# EAGLE design Slicow Senzor (EAGLE 5.11)
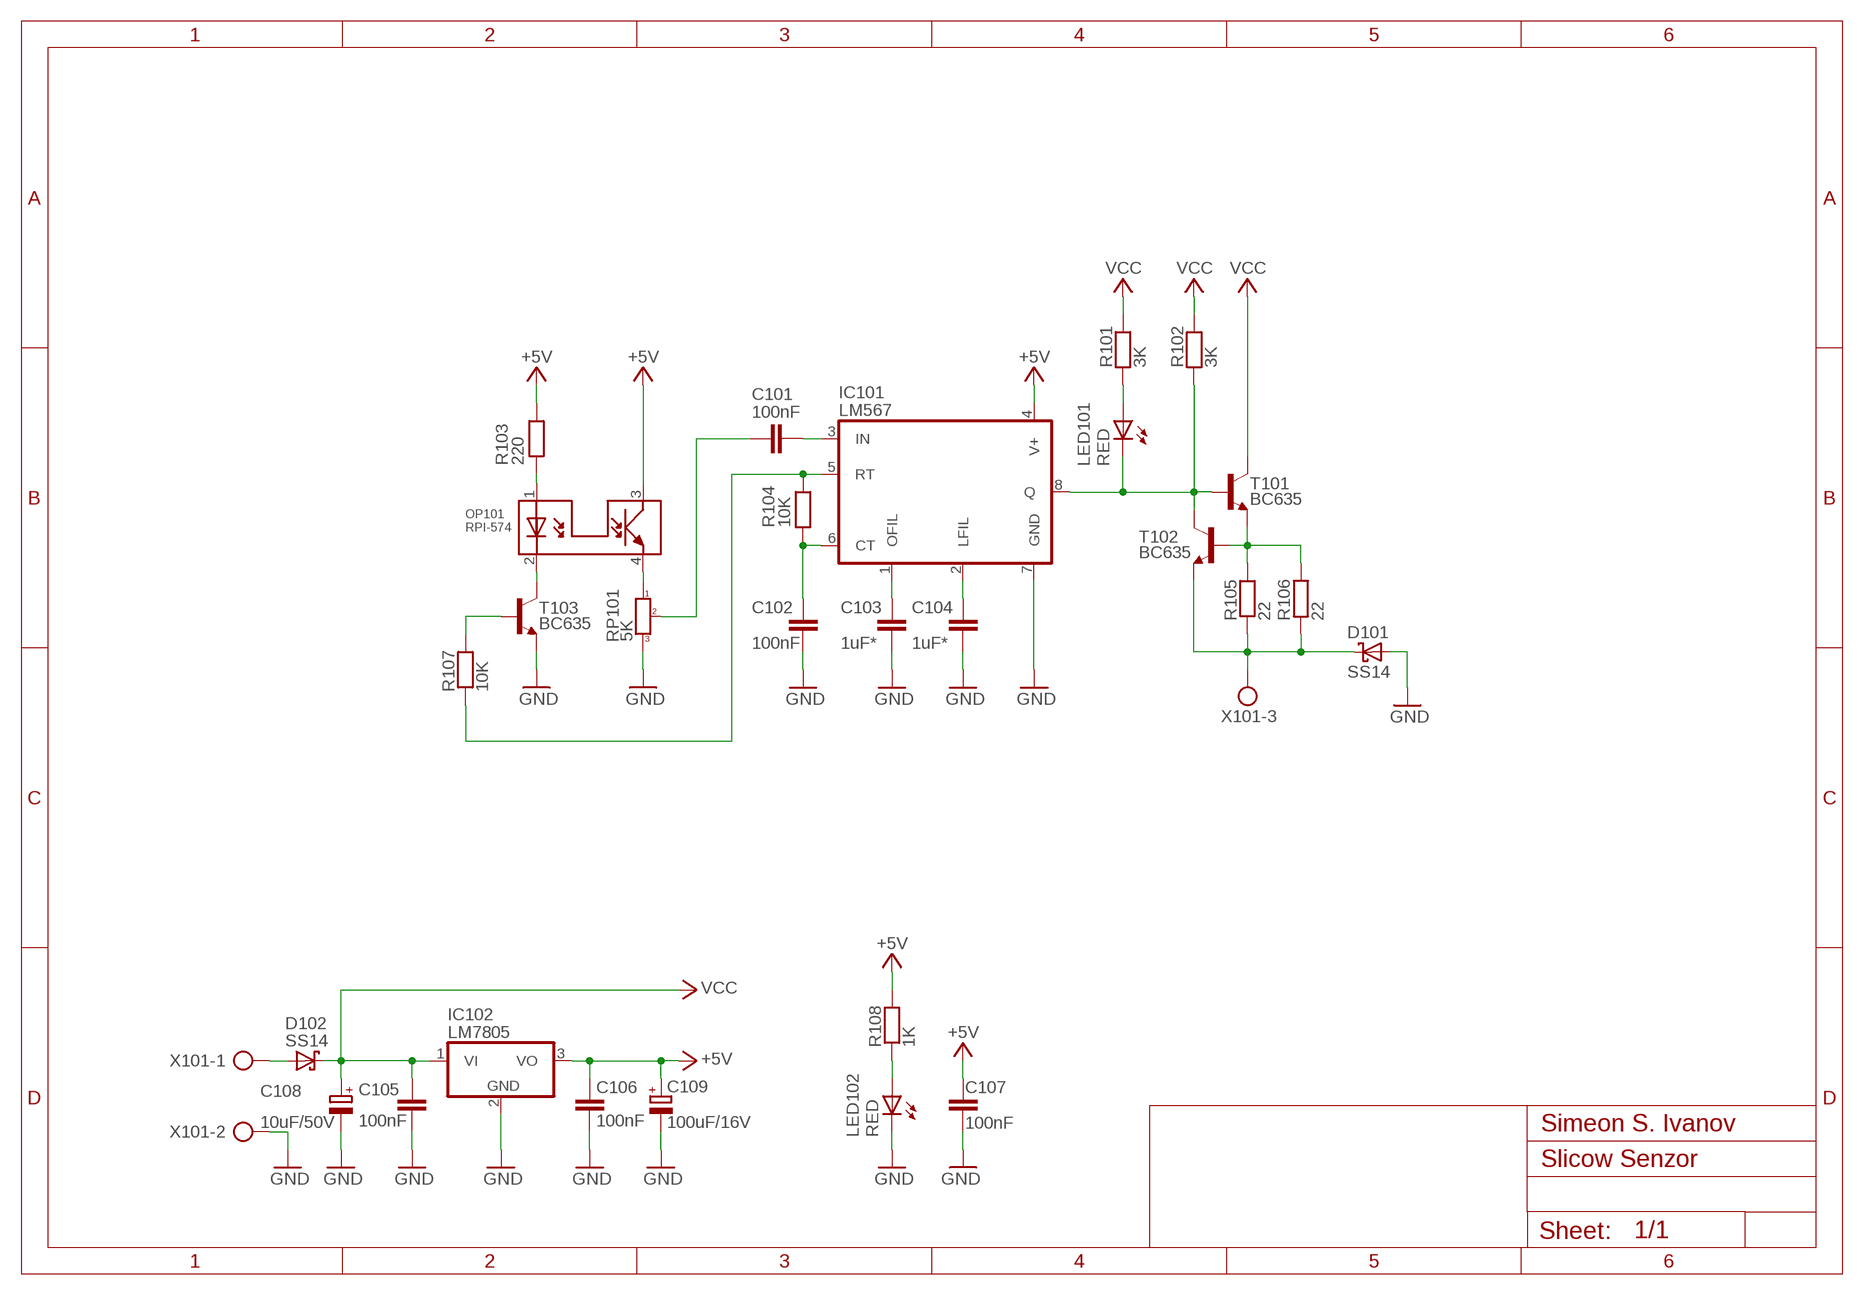
[diagram p0: schematic, sheet 1]

## Parts
C101  100nF  C-EUC0805  [C0805]
C102  100nF  C-EUC0805  [C0805]
C103  1uF*  C-EUC0805  [C0805]
C104  1uF*  C-EUC0805  [C0805]
C105  100nF  C-EUC0805  [C0805]
C106  100nF  C-EUC0805  [C0805]
C107  100nF  C-EUC0805  [C0805]
C108  10uF/50V  CPOL-EU_Ø250  [CP100X80X24]
C109  100uF/16V  CPOL-EU_Ø250  [CP100X80X24]
D101  SS14  1N581SMD  [DO214AC]
D102  SS14  1N581SMD  [DO214AC]
IC101  LM567  LM567DIL8-HOME  [DIL8-HOME]
IC102  LM7805  78TO220V-HOME  [TO220V-HOME]
LED101  RED  LEDLED3MM-HOME  [LED3MM-HOME]
LED102  RED  LEDLED3MM-HOME  [LED3MM-HOME]
OP101  RPI-574  RPI-574HOME  [RPI-574-HOME]
R101  3K  R-EU_3  [R200X86X24]
R102  3K  R-EU_3  [R200X86X24]
R103  220  R-EU_3  [R200X86X24]
R104  10K  R-EU_1  [R100X80X24]
R105  22  R-EU_1  [R100X80X24]
R106  22  R-EU_1  [R100X80X24]
R107  10K  R-EU_15  [R250X80X19]
R108  1K  R-EU_16  [R400X80X19]
RP101  5K  RP-EU_HOME  [RP0]
T101  BC635  BC635-NPN-TO92-BCE-HOME  [TO92-BCE-HOME]
T102  BC635  BC635-NPN-TO92-BCE-HOME  [TO92-BCE-HOME]
T103  BC635  BC635-NPN-TO92-BCE-HOME  [TO92-BCE-HOME]
X101  AK500/31  [AWG/3-H]

## Nets
+5V: C106.1 C107.1 C109.+(+1) IC101.4(V+) IC102.3(VO) OP101.3(C) R103.P$2 R108.P$2
GND: C102.2 C103.2 C104.2 C105.2 C106.2 C107.2 C108.-(-1) C109.-(-1) D101.A IC101.7(GND) IC102.2(GND) LED102.K(C) RP101.3 T103.E X101.2
N$1: R105.P$2 R106.P$1 T101.E T102.B
N$2: C101.2 IC101.3(IN)
N$3: D102.A X101.1
N$4: R107.P$2 T103.B
N$5: OP101.2(K) T103.C
N$6: C102.1 IC101.6(CT) R104.P$1
N$7: LED102.A R108.P$1
N$8: C103.1 IC101.1(OFIL)
N$9: C104.1 IC101.2(LFIL)
N$10: D101.C R105.P$1 R106.P$2 T102.E X101.3
N$11: IC101.8(Q) LED101.K(C) R102.P$1 T101.B T102.C
N$12: C101.1 RP101.2
N$13: LED101.A R101.P$1
N$14: OP101.4(E) RP101.1
N$15: OP101.1(A) R103.P$1
OSC: IC101.5(RT) R104.P$2 R107.P$1
VCC: C105.1 C108.+(+1) D102.C IC102.1(VI) R101.P$2 R102.P$2 T101.C

## Notes on the sheet
- Simeon S. Ivanov

## Library data of the parts
C101-C107 = rcl:C-EU: CAPACITOR, European symbol
C108 C109 = myRcl:CPOL-EU_
D101 D102 = diode:1N581*: 1.0A SCHOTTKY BARRIER RECTIFIER Source: http://www.diodes.com/datasheets/ds23001.pdf
IC101 = linear:LM567
IC102 = linear:78*: Positive VOLTAGE REGULATOR Source: http://cache.national.com/ds/LM/LM78L05.pdf http://www.fairchildsemi.com/ds/LM/LM7805.pdf
LED101 LED102 = led:LED: LED OSRAM: - CHIPLED LG R971, LG N971, LY N971, LG Q971, LY Q971, LO R971, LY R971 LH N974, LH R974 LS Q976, LO Q976, LY Q976 LO Q996 - Hyper CHIPLED LW Q18S LB Q993, LB Q99A, LB R99A - SideLED LS A670, LO A670, LY A670, LG A670, LP A670 LB A673, LV A673, LT A673, LW A673 LH A674 LY A675 LS A676, LA A676, LO A676, LY A676, LW A676 LS A679, LY A679, LG A679 - Hyper Micro SIDELED® LS Y876, LA Y876, LO Y876, LY Y876 LT Y87S - SmartLED LW L88C, LW L88S LB L89C, LB L89S, LG L890 LS L89K, LO L89K, LY L89K LS L896, LA L896, LO L896, LY L896 - TOPLED LS T670, LO T670, LY T670, LG T670, LP T670 LSG T670, LSP T670, LSY T670, LOP T670, LYG T670 LG T671, LOG T671, LSG T671 LB T673, LV T673, LT T673, LW T673 LH T674 LS T676, LA T676, LO T676, LY T676, LB T676, LH T676, LSB T676, LW T676 LB T67C, LV T67C, LT T67C, LS T67K, LO T67K, LY T67K, LW E67C LS E67B, LA E67B, LO E67B, LY E67B, LB E67C, LV E67C, LT E67C LW T67C LS T679, LY T679, LG T679 LS T770, LO T770, LY T770, LG T770, LP T770 LB T773, LV T773, LT T773, LW T773 LH T774 LS E675, LA E675, LY E675, LS T675 LS T776, LA T776, LO T776, LY T776, LB T776 LHGB T686 LT T68C, LB T68C - Hyper Mini TOPLED® LB M676 - Mini TOPLED Santana® LG M470 LS M47K, LO M47K, LY M47K Source: http://www.osram.convergy.de LUXEON: - LUMILED® LXK2-PW12-R00, LXK2-PW12-S00, LXK2-PW14-U00, LXK2-PW14-V00 LXK2-PM12-R00, LXK2-PM12-S00, LXK2-PM14-U00 LXK2-PE12-Q00, LXK2-PE12-R00, LXK2-PE12-S00, LXK2-PE14-T00, LXK2-PE14-U00 LXK2-PB12-K00, LXK2-PB12-L00, LXK2-PB12-M00, LXK2-PB14-N00, LXK2-PB14-P00, LXK2-PB14-Q00 LXK2-PR12-L00, LXK2-PR12-M00, LXK2-PR14-Q00, LXK2-PR14-R00 LXK2-PD12-Q00, LXK2-PD12-R00, LXK2-PD12-S00 LXK2-PH12-R00, LXK2-PH12-S00 LXK2-PL12-P00, LXK2-PL12-Q00, LXK2-PL12-R00 Source: www.luxeon.com KINGBRIGHT: KA-3528ASYC Source: www.kingbright.com
OP101 = optocoupler:RPI-574
R101-R108 = myRcl:R-EU_: RESISTOR, European symbol
RP101 = myRcl:RP-EU_
T101-T103 = transistor:*-NPN-: NPN Transistror BF959 corrected 2008.03.06
X101 = con-ptr500:AK500/3: CONNECTOR

## Board
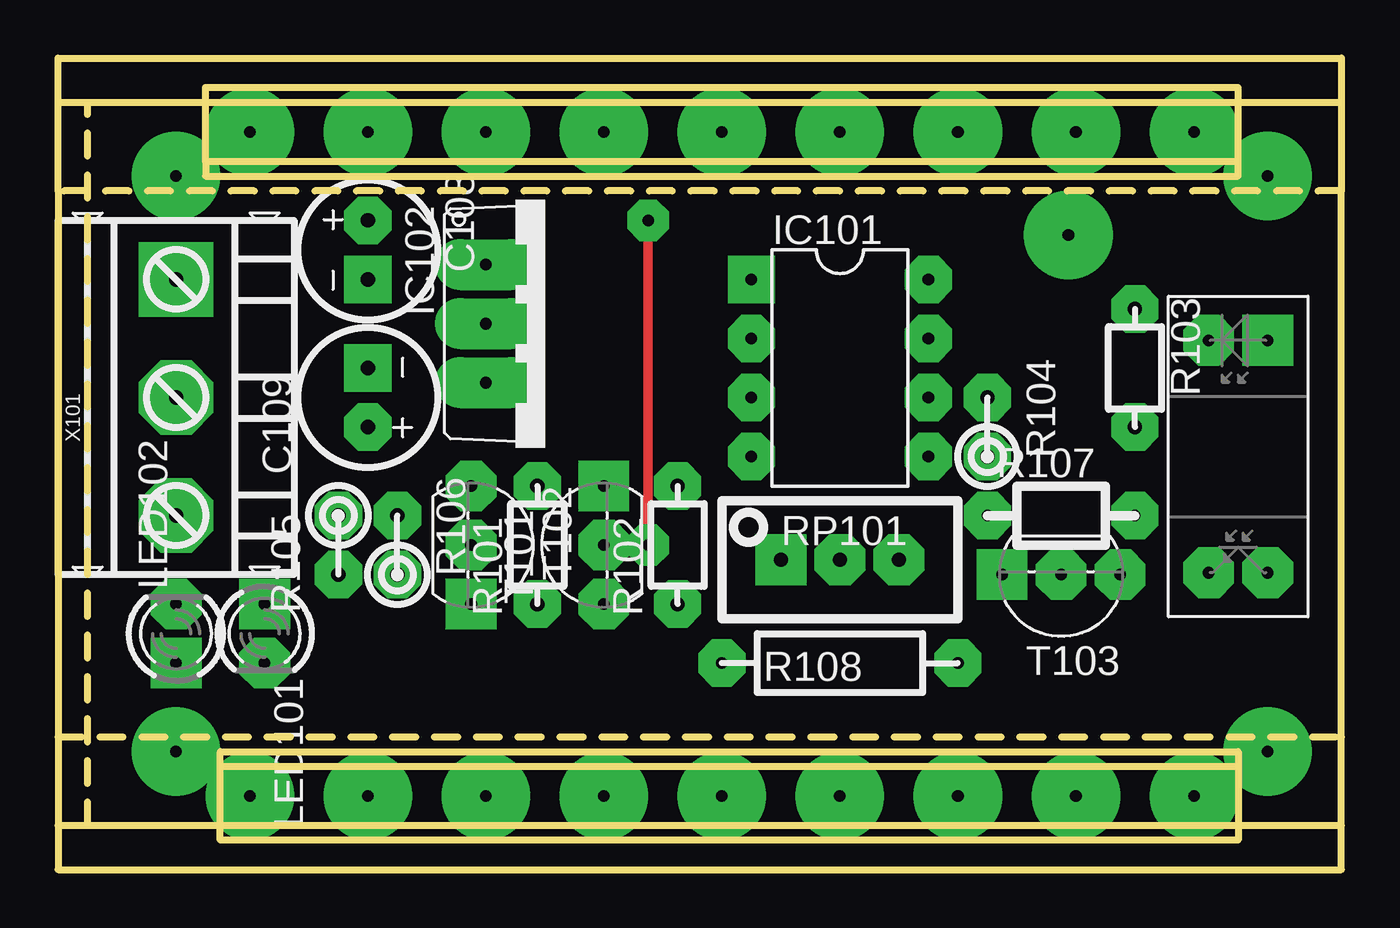
[diagram p1: board, top side]
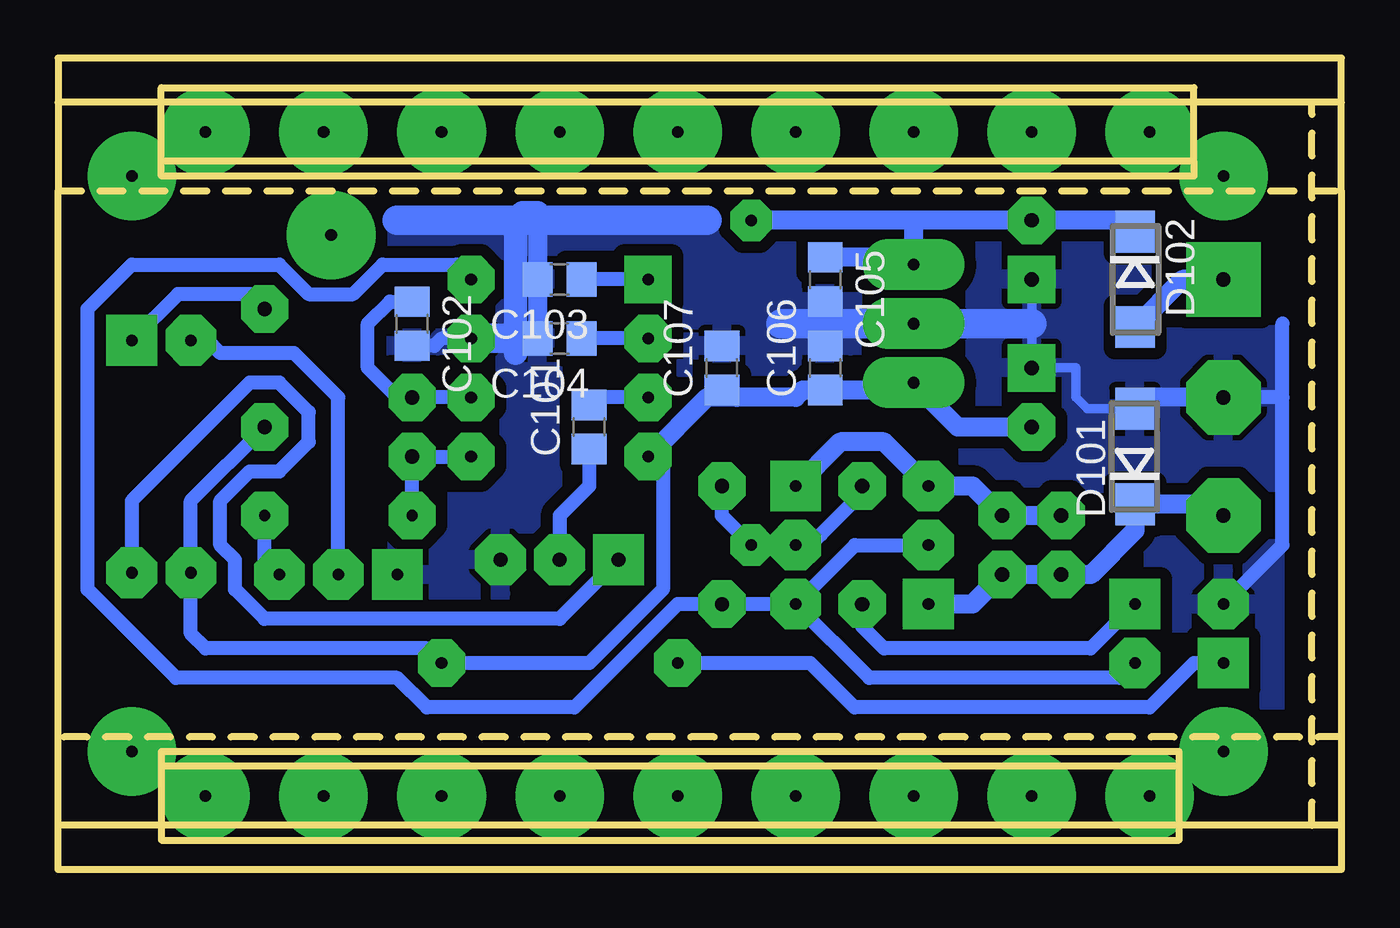
[diagram p2: board, bottom side, seen from below]

Size 55.24 x 34.92 mm. Coordinates in mm from the lower left corner, seen from the top.
Outline: 0,5.71 55.24,5.71
Outline: 55.24,5.71 55.24,29.21
Outline: 55.24,29.21 0,29.21
Outline: 0,29.21 0,5.71
Outline: 0,5.71 0,1.9
Outline: 0,1.9 1.27,1.9
Outline: 1.27,1.9 55.24,1.9
Outline: 55.24,1.9 55.24,5.71
Outline: 0,29.21 0,33.02
Outline: 0,33.02 1.27,33.02
Outline: 1.27,33.02 55.24,33.02
Outline: 55.24,33.02 55.24,29.21
Outline: 1.27,1.9 1.27,33.02
Outline: 0,1.9 0,0 55.24,0 55.24,1.9
Outline: 0,33.02 0,34.92 55.24,34.92 55.24,33.02
Outline: 6.35,30.48 50.8,30.48
Outline: 6.99,4.45 50.8,4.45
Outline: 6.99,4.45 6.99,5.08 50.8,5.08 50.8,4.45
Outline: 50.8,4.45 50.8,1.27 6.99,1.27 6.99,4.45
Outline: 6.35,30.48 6.35,29.84 50.8,29.84 50.8,30.48
Outline: 50.8,30.48 50.8,33.66 6.35,33.66 6.35,30.48
Copper layers (1*16): Top 0.035mm / dielectric 1.5mm / Bottom 0.035mm
Design rules "default *": minimum track width 24mil, minimum drill 24mil, track to track 8mil, track to pad 8mil, pad to pad 8mil, via to via 8mil, smd to smd 8mil, copper to edge 40mil, drill to drill 8mil, minimum pad ring 10mil, minimum via ring 8mil, stop-mask expansion 4mil, vias tented up to drill 0mil, thermal gap 10mil

### Footprints (pad centres in the part's own frame; a part is rotated, then mirrored left to right if it is on the bottom)
C0805 = smd 1.3 x 1.5: 1 -0.95,0; 2 0.95,0
CP100X80X24 = drill 0.61 pad 2.032 octagon: + -1.27,0 | drill 0.61 pad 2.032 square: - 1.27,0
DO214AC = smd 1.8 x 1.7: A 2.05,0; C -2.05,0
DIL8-HOME = drill 0.5 pad 2.032 square: 1 -3.81,-3.81 | drill 0.5 pad 2.032 octagon: 2 -1.27,-3.81; 3 1.27,-3.81; 4 3.81,-3.81; 5 3.81,3.81; 6 1.27,3.81; 7 -1.27,3.81; 8 -3.81,3.81
TO220V-HOME = drill 0.5 pad 2.184 long: 1 -2.54,-2.54; 2 0,-2.54; 3 2.54,-2.54
LED3MM-HOME = drill 0.5 pad 2.184 square: A -1.27,0 | drill 0.5 pad 2.184 octagon: K 1.27,0
RPI-574-HOME = drill 0.5 pad 2.184 square: 1 -5,1.27 | drill 0.5 pad 2.184 octagon: 2 -5,-1.27; 3 5,-1.27; 4 5,1.27
R200X86X24 = drill 0.61 pad 2.032 octagon: P$1 -2.54,0; P$2 2.54,0
R100X80X24 = drill 0.61 pad 2.032 octagon: P$1 -1.27,0; P$2 1.27,0
R250X80X19 = drill 0.483 pad 2.032 octagon: P$1 -3.81,0; P$2 2.54,0
R400X80X19 = drill 0.5 pad 2.032 octagon: P$1 -5.08,0; P$2 5.08,0
RP0 = drill 0.61 pad 2.184 square: 1 -2.54,0 | drill 0.61 pad 2.184 octagon: 2 0,0; 3 2.54,0
TO92-BCE-HOME = drill 0.5 pad 2.184 octagon: B -2.54,0; C 0,0 | drill 0.5 pad 2.184 square: E 2.54,0
AWG/3-H = drill 0.61 pad 3.2 square: 1 5.08,0 | drill 0.61 pad 3.2 octagon: 2 0,0; 3 -5.08,0

### Placement (x,y rotation side)
C101  32.38,19.05 90 bottom
C102  40.01,23.5 270 bottom
C103  33.66,25.4 180 bottom
C104  33.66,22.86 180 bottom
C105  22.23,25.4 270 bottom
C106  22.23,21.59 90 bottom
C107  26.67,21.59 90 bottom
C108  13.34,26.67 270 top
C109  13.34,20.32 90 top
D101  8.89,17.78 90 bottom
D102  8.89,25.4 270 bottom
IC101  33.66,21.59 270 top
IC102  20.95,23.5 270 top
LED101  8.89,10.16 270 top
LED102  5.08,10.16 90 top
OP101  50.8,17.78 270 top
R101  20.63,13.97 90 top
R102  26.67,13.97 90 top
R103  46.35,21.59 270 top
R104  40.01,19.05 270 top
R105  12.06,13.97 90 top
R106  14.61,13.97 270 top
R107  43.81,15.24 0 top
R108  33.66,8.89 0 top
RP101  33.66,13.34 0 top
T101  23.5,13.97 90 top
T102  17.78,13.97 270 top
T103  43.18,12.7 180 top
X101  5.08,20.32 90 top

### Tracks (layer width: path | path; a pad name or v marks a point on that pad's centre or on a via)
+5V
  Bottom 0.61: IC101.4 29.21,17.78 29.21,12.06 32.38,8.89 R108.P$2 39.37,9.53 48.9,9.53 49.53,10.16 OP101.3 49.53,15.88 R103.P$2
  Bottom 0.813: C109.+ 16.51,19.05 IC102.3 18.73,20.64 C106.1 23.18,20.64 23.5,20.32 26.04,20.32 | 26.04,20.32 C107.1 | 26.04,20.32 27.3,20.32 IC101.4
GND
  Bottom 0.406: C108.- 13.34,23.5 C109.- 11.43,21.59 11.43,20.32 10.94,19.83 D101.A | 22.23,23.5 C106.2 | 24.13,23.5 22.23,23.5 | 22.23,23.5 C105.2
  Bottom 0.61: LED102.K 2.54,13.97 2.54,20.32 | 2.54,20.32 2.54,23.5 | 2.54,20.32 X101.2 | 34.29,27.94 34.6,28.26 | C102.2 39.05,22.54 38.73,22.86 IC101.7
  Bottom 0.813: X101.2 8.4,20.32 D101.A | 34.6,28.26 C104.2
  Bottom 1.016: 35.56,22.23 35.56,27.94 35.24,28.26 34.6,28.26
  Bottom 1.27: 13.34,23.5 IC102.2 24.13,23.5 | C104.2 IC101.7 | 27.3,27.94 34.29,27.94 40.64,27.94
  pour Bottom (isolate 0.508): 0,29.21 55.24,29.84 55.24,5.71 0,5.71
N$1
  Bottom 0.813: R105.P$2 R106.P$1 15.88,16.51 T102.B 19.68,18.41 21.58,18.41 23.48,16.51 T101.E
N$2
  Bottom 0.61: IC101.3 32.06,20.32 C101.2
N$3
  Bottom 0.813: X101.1 6.84,25.4 D102.A
N$4
  Bottom 0.61: R107.P$2 46.35,13.34 T103.B
N$5
  Bottom 0.61: T103.C 43.18,20.32 45.09,22.23 48.26,22.23 48.81,22.78 OP101.2
N$6
  Bottom 0.61: IC101.6 R104.P$1 40.64,20.32 41.91,21.59 41.91,23.5 40.96,24.45 C102.1
N$7
  Bottom 0.61: LED102.A 6.35,8.89 8.26,6.98 20.95,6.98 22.86,8.89 R108.P$1
N$8
  Bottom 0.61: IC101.1 C103.1
N$9
  Bottom 0.61: IC101.2 C104.1
N$10
  Bottom 0.813: X101.3 5.57,15.73 D101.C 8.89,14.61 10.79,12.7 R105.P$1 R106.P$2 15.88,11.43 T102.E
N$11
  Bottom 0.61: T101.B R102.P$1 28.57,11.43 33.02,6.98 39.37,6.98 40.64,8.25 50.16,8.25 53.98,12.06 53.98,24.13 52.07,26.04 45.72,26.04 44.45,24.77 42.55,24.77 41.27,26.04 38.1,26.04 IC101.8 | LED101.K 9.53,8.25 20.32,8.25 T101.B | T101.B 23.48,11.43 20.94,13.97 T102.C
N$12
  Bottom 0.61: RP101.2 33.66,15.24 32.38,16.51 C101.1
N$13
  Bottom 0.61: LED101.A 10.79,9.53 19.68,9.53 20.63,10.47 R101.P$1
N$14
  Bottom 0.61: RP101.1 33.66,10.79 46.35,10.79 47.62,12.06 47.62,13.34 48.26,13.97 48.26,15.88 46.99,17.14 45.72,17.14 44.45,18.41 44.45,19.69 45.72,20.95 46.99,20.95 52.07,15.88 OP101.4
N$15
  Bottom 0.61: R103.P$1 46.99,24.77 50.09,24.77 OP101.1
N$16  (via drill 0.5 pad 3.81)
  other vias: 5.08,29.84
N$17  (via drill 0.5 pad 3.81)
  other vias: 5.08,5.08
N$18  (via drill 0.5 pad 3.81)
  other vias: 52.07,5.08
N$19  (via drill 0.5 pad 3.81)
  other vias: 52.07,29.84
N$20  (via drill 0.5 pad 3.81)
  other vias: 13.34,31.75
N$21  (via drill 0.5 pad 3.81)
  other vias: 18.41,31.75
N$22  (via drill 0.5 pad 3.81)
  other vias: 23.5,31.75
N$23  (via drill 0.5 pad 3.81)
  other vias: 28.57,31.75
N$24  (via drill 0.5 pad 3.81)
  other vias: 33.66,31.75
N$25  (via drill 0.5 pad 3.81)
  other vias: 38.73,31.75
N$26  (via drill 0.5 pad 3.81)
  other vias: 43.81,31.75
N$27  (via drill 0.5 pad 3.81)
  other vias: 48.9,31.75
N$28  (via drill 0.5 pad 3.81)
  other vias: 8.26,31.75
N$29  (via drill 0.5 pad 3.81)
  other vias: 8.26,3.17
N$30  (via drill 0.5 pad 3.81)
  other vias: 13.34,3.17
N$31  (via drill 0.5 pad 3.81)
  other vias: 18.41,3.17
N$32  (via drill 0.5 pad 3.81)
  other vias: 23.5,3.17
N$33  (via drill 0.5 pad 3.81)
  other vias: 28.57,3.17
N$34  (via drill 0.5 pad 3.81)
  other vias: 33.66,3.17
N$35  (via drill 0.5 pad 3.81)
  other vias: 38.73,3.17
N$36  (via drill 0.5 pad 3.81)
  other vias: 43.81,3.17
N$37  (via drill 0.5 pad 3.81)
  other vias: 48.9,3.17
N$38  (via drill 0.5 pad 3.81)
  other vias: 43.49,27.3
OSC
  Bottom 0.61: IC101.5 R104.P$2 R107.P$1
VCC  (via drill 0.5 pad 1.78)
  Top 0.406: v25.4,27.94 v25.4,13.97
  Bottom 0.61: T101.C 24.13,13.97 | T101.C v25.4,13.97 26.67,15.24 R102.P$2 | T101.C 22.86,13.97 22.4,14.43 20.63,16.2 R101.P$2
  Bottom 0.813: C105.1 18.73,26.35 IC102.1 18.41,27.94 | 9.67,27.94 9.38,27.94 D102.C 9.67,27.94 | 18.41,27.94 C108.+ 9.67,27.94 | 18.41,27.94 v25.4,27.94